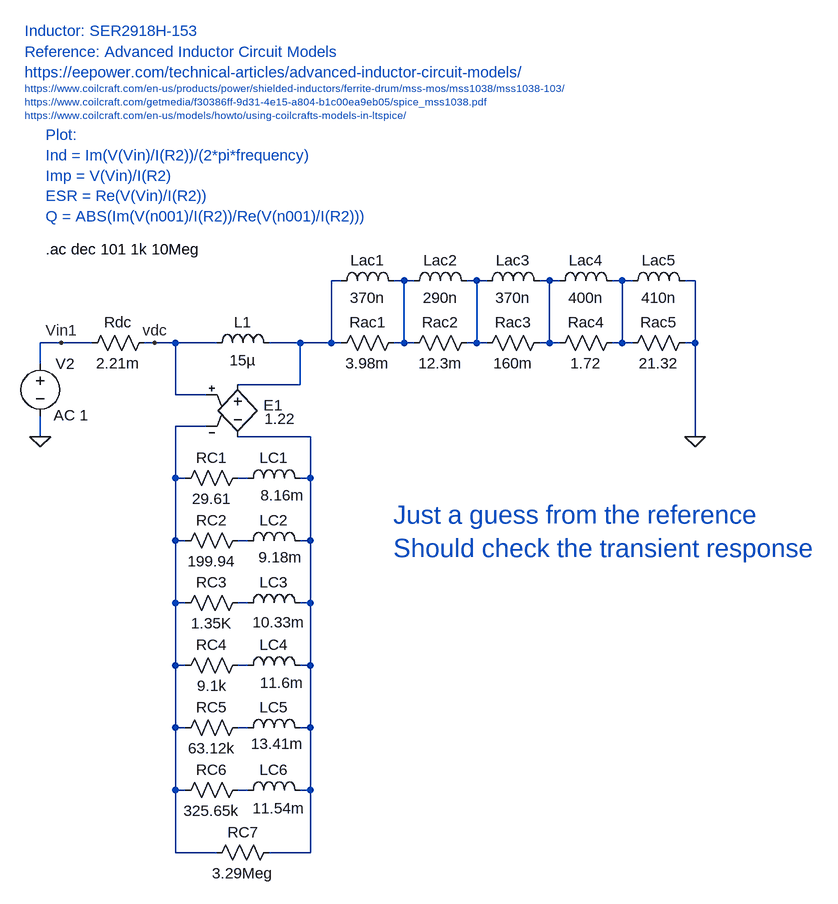
[diagram p0: schematic 08-SER2918H-153_non-linear_model_ridley.asc]
08-SER2918H-153_non-linear_model_ridley.asc, the LTspice schematic file:
Version 4
SHEET 1 1668 1520
WIRE 96 112 80 112
WIRE 192 112 176 112
WIRE 208 112 192 112
WIRE 304 112 288 112
WIRE 320 112 304 112
WIRE 416 112 400 112
WIRE 432 112 416 112
WIRE 528 112 512 112
WIRE 544 112 528 112
WIRE 640 112 624 112
WIRE -336 208 -368 208
WIRE -288 208 -336 208
WIRE -192 208 -208 208
WIRE -160 208 -192 208
WIRE -96 208 -160 208
WIRE 32 208 -16 208
WIRE 80 208 80 112
WIRE 80 208 32 208
WIRE 96 208 80 208
WIRE 192 208 192 112
WIRE 192 208 176 208
WIRE 208 208 192 208
WIRE 304 208 304 112
WIRE 304 208 288 208
WIRE 320 208 304 208
WIRE 416 208 416 112
WIRE 416 208 400 208
WIRE 432 208 416 208
WIRE 528 208 528 112
WIRE 528 208 512 208
WIRE 544 208 528 208
WIRE 640 208 640 112
WIRE 640 208 624 208
WIRE -368 240 -368 208
WIRE 32 272 32 208
WIRE 32 272 -64 272
WIRE -160 288 -160 208
WIRE -112 288 -160 288
WIRE -112 336 -160 336
WIRE -368 352 -368 320
WIRE 48 352 -64 352
WIRE 640 352 640 208
WIRE -160 416 -160 336
WIRE -144 416 -160 416
WIRE -48 416 -64 416
WIRE 48 416 48 352
WIRE 48 416 32 416
WIRE -160 512 -160 416
WIRE -144 512 -160 512
WIRE -48 512 -64 512
WIRE 48 512 48 416
WIRE 48 512 32 512
WIRE -160 608 -160 512
WIRE -144 608 -160 608
WIRE -48 608 -64 608
WIRE 48 608 48 512
WIRE 48 608 32 608
WIRE -160 704 -160 608
WIRE -144 704 -160 704
WIRE -48 704 -64 704
WIRE 48 704 48 608
WIRE 48 704 32 704
WIRE -160 800 -160 704
WIRE -144 800 -160 800
WIRE -48 800 -64 800
WIRE 48 800 48 704
WIRE 48 800 32 800
WIRE -160 896 -160 800
WIRE -144 896 -160 896
WIRE -48 896 -64 896
WIRE 48 896 48 800
WIRE 48 896 32 896
WIRE -160 992 -160 896
WIRE -96 992 -160 992
WIRE 48 992 48 896
WIRE 48 992 -16 992
FLAG -368 352 0
FLAG 640 352 0
FLAG -336 208 Vin1
FLAG -192 208 vdc
SYMBOL voltage -368 224 R0
WINDOW 123 21 95 Left 2
WINDOW 39 0 0 Left 0
SYMATTR Value2 AC 1
SYMATTR InstName V2
SYMATTR Value ""
SYMBOL res -192 192 R90
WINDOW 0 0 56 VBottom 2
WINDOW 3 32 56 VTop 2
SYMATTR InstName Rdc
SYMATTR Value 2.21m
SYMBOL res 192 192 R90
WINDOW 0 0 56 VBottom 2
WINDOW 3 32 56 VTop 2
SYMATTR InstName Rac1
SYMATTR Value 3.98m
SYMBOL res 304 192 R90
WINDOW 0 0 56 VBottom 2
WINDOW 3 32 56 VTop 2
SYMATTR InstName Rac2
SYMATTR Value 12.3m
SYMBOL res 416 192 R90
WINDOW 0 0 56 VBottom 2
WINDOW 3 32 56 VTop 2
SYMATTR InstName Rac3
SYMATTR Value 160m
SYMBOL res 528 192 R90
WINDOW 0 0 56 VBottom 2
WINDOW 3 32 56 VTop 2
SYMATTR InstName Rac4
SYMATTR Value 1.72
SYMBOL res 640 192 R90
WINDOW 0 0 56 VBottom 2
WINDOW 3 32 56 VTop 2
SYMATTR InstName Rac5
SYMATTR Value 21.32
SYMBOL ind 80 128 R270
WINDOW 0 32 56 VTop 2
WINDOW 3 5 56 VBottom 2
SYMATTR InstName Lac1
SYMATTR Value 370n
SYMBOL ind 192 128 R270
WINDOW 0 32 56 VTop 2
WINDOW 3 5 56 VBottom 2
SYMATTR InstName Lac2
SYMATTR Value 290n
SYMBOL ind 304 128 R270
WINDOW 0 32 56 VTop 2
WINDOW 3 5 56 VBottom 2
SYMATTR InstName Lac3
SYMATTR Value 370n
SYMBOL ind 416 128 R270
WINDOW 0 32 56 VTop 2
WINDOW 3 5 56 VBottom 2
SYMATTR InstName Lac4
SYMATTR Value 400n
SYMBOL ind 528 128 R270
WINDOW 0 32 56 VTop 2
WINDOW 3 5 56 VBottom 2
SYMATTR InstName Lac5
SYMATTR Value 410n
SYMBOL ind -112 224 R270
WINDOW 0 32 56 VTop 2
WINDOW 3 5 56 VBottom 2
SYMATTR InstName L1
SYMATTR Value 15µ
SYMBOL res -48 400 R90
WINDOW 0 0 56 VBottom 2
WINDOW 3 32 56 VTop 2
SYMATTR InstName RC1
SYMATTR Value 29.61
SYMBOL ind -64 432 R270
WINDOW 0 32 56 VTop 2
WINDOW 3 5 69 VBottom 2
SYMATTR InstName LC1
SYMATTR Value 8.16m
SYMBOL res -48 496 R90
WINDOW 0 0 56 VBottom 2
WINDOW 3 32 56 VTop 2
SYMATTR InstName RC2
SYMATTR Value 199.94
SYMBOL ind -64 528 R270
WINDOW 0 32 56 VTop 2
WINDOW 3 6 66 VBottom 2
SYMATTR InstName LC2
SYMATTR Value 9.18m
SYMBOL res -48 592 R90
WINDOW 0 0 56 VBottom 2
WINDOW 3 32 56 VTop 2
SYMATTR InstName RC3
SYMATTR Value 1.35K
SYMBOL ind -64 624 R270
WINDOW 0 32 56 VTop 2
WINDOW 3 2 63 VBottom 2
SYMATTR InstName LC3
SYMATTR Value 10.33m
SYMBOL res -48 688 R90
WINDOW 0 0 56 VBottom 2
WINDOW 3 32 56 VTop 2
SYMATTR InstName RC4
SYMATTR Value 9.1k
SYMBOL ind -64 720 R270
WINDOW 0 32 56 VTop 2
WINDOW 3 5 68 VBottom 2
SYMATTR InstName LC4
SYMATTR Value 11.6m
SYMBOL res -48 784 R90
WINDOW 0 0 56 VBottom 2
WINDOW 3 32 56 VTop 2
SYMATTR InstName RC5
SYMATTR Value 63.12k
SYMBOL ind -64 816 R270
WINDOW 0 32 56 VTop 2
WINDOW 3 7 61 VBottom 2
SYMATTR InstName LC5
SYMATTR Value 13.41m
SYMBOL res -48 880 R90
WINDOW 0 0 56 VBottom 2
WINDOW 3 32 56 VTop 2
SYMATTR InstName RC6
SYMATTR Value 325.65k
SYMBOL ind -64 912 R270
WINDOW 0 32 56 VTop 2
WINDOW 3 4 63 VBottom 2
SYMATTR InstName LC6
SYMATTR Value 11.54m
SYMBOL res 0 976 R90
WINDOW 0 0 56 VBottom 2
WINDOW 3 32 56 VTop 2
SYMATTR InstName RC7
SYMATTR Value 3.29Meg
SYMBOL e -64 256 R0
WINDOW 0 40 48 Left 2
WINDOW 3 41 69 Left 2
SYMATTR InstName E1
SYMATTR Value 1.22
TEXT -360 64 Left 2 !.ac dec 101 1k 10Meg
TEXT -392 -272 Left 2 ;Inductor: SER2918H-153
TEXT -392 -184 Left 1 ;https://www.coilcraft.com/en-us/products/power/shielded-inductors/ferrite-drum/mss-mos/mss1038/mss1038-103/\nhttps://www.coilcraft.com/getmedia/f30386ff-9d31-4e15-a804-b1c00ea9eb05/spice_mss1038.pdf\nhttps://www.coilcraft.com/en-us/models/howto/using-coilcrafts-models-in-ltspice/
TEXT -360 -112 Left 2 ;Plot:\nInd = Im(V(Vin)/I(R2))/(2*pi*frequency)\nImp = V(Vin)/I(R2)\nESR = Re(V(Vin)/I(R2))\nQ = ABS(Im(V(n001)/I(R2))/Re(V(n001)/I(R2)))
TEXT -392 -240 Left 2 ;Reference: Advanced Inductor Circuit Models\nhttps://eepower.com/technical-articles/advanced-inductor-circuit-models/
TEXT 176 472 Left 4 ;Just a guess from the reference\nShould check the transient response

The netlist it stands for:
* 08-SER2918H-153_non-linear_model_ridley.asc
V2 Vin1 0 AC 1
Rdc vdc Vin1 2.21m
Rac1 N002 N001 3.98m
Rac2 N003 N002 12.3m
Rac3 N004 N003 160m
Rac4 N005 N004 1.72
Rac5 0 N005 21.32
Lac1 N001 N002 370n
Lac2 N002 N003 290n
Lac3 N003 N004 370n
Lac4 N004 N005 400n
Lac5 N005 0 410n
L1 vdc N001 15µ
RC1 N008 N006 29.61
LC1 N008 N007 8.16m
RC2 N009 N006 199.94
LC2 N009 N007 9.18m
RC3 N010 N006 1.35K
LC3 N010 N007 10.33m
RC4 N011 N006 9.1k
LC4 N011 N007 11.6m
RC5 N012 N006 63.12k
LC5 N012 N007 13.41m
RC6 N013 N006 325.65k
LC6 N013 N007 11.54m
RC7 N007 N006 3.29Meg
E1 N001 N007 vdc N006 1.22
.ac dec 101 1k 10Meg
* Inductor: SER2918H-153
* https://www.coilcraft.com/en-us/products/power/shielded-inductors/ferrite-drum/mss-mos/mss1038/mss1038-103/
* https://www.coilcraft.com/getmedia/f30386ff-9d31-4e15-a804-b1c00ea9eb05/spice_mss1038.pdf
* https://www.coilcraft.com/en-us/models/howto/using-coilcrafts-models-in-ltspice/
* Plot:
* Ind = Im(V(Vin)/I(R2))/(2*pi*frequency)
* Imp = V(Vin)/I(R2)
* ESR = Re(V(Vin)/I(R2))
* Q = ABS(Im(V(n001)/I(R2))/Re(V(n001)/I(R2)))
* Reference: Advanced Inductor Circuit Models
* https://eepower.com/technical-articles/advanced-inductor-circuit-models/
* Just a guess from the reference
* Should check the transient response
.backanno
.end

* Results of the author's LTspice run, read from the files saved beside the schematic
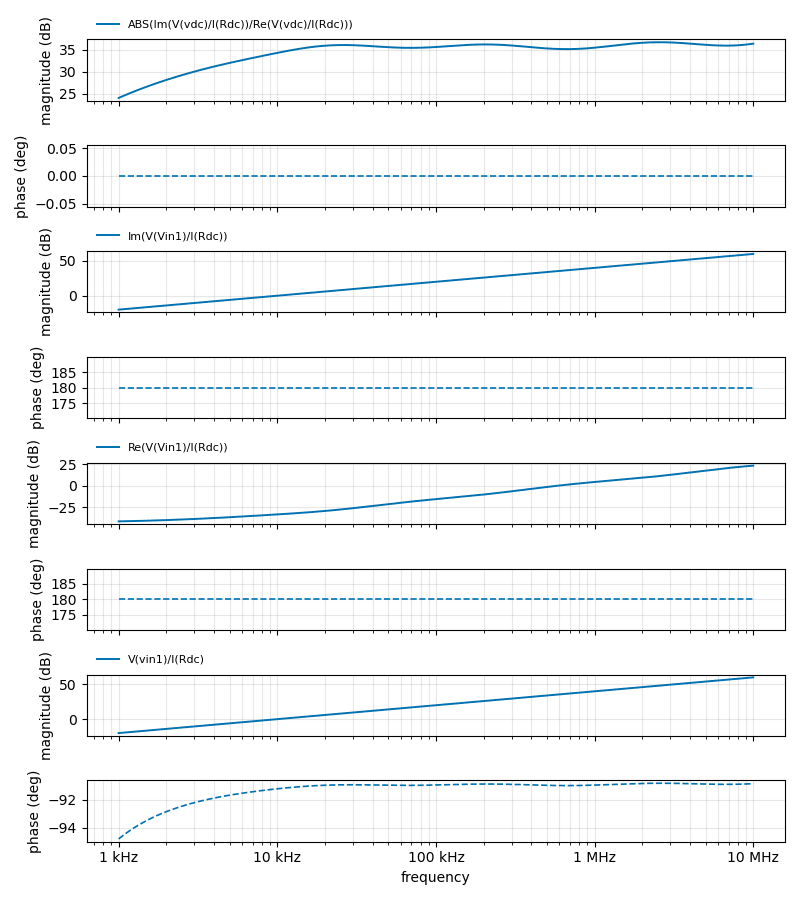
[diagram p1: AC Analysis of 08-SER2918H-153_non-linear_model_ridley.asc, plotted from the saved traces]
* AC Analysis, 1 run:
*   ABS(Im(V(vdc)/I(Rdc))/Re(V(vdc)/I(Rdc))): 24.07 dB at 1 kHz, 36.33 dB at 10 MHz, peak 36.65 dB at 2.546 MHz, 3 dB below the peak at 8.248 kHz
*   Im(V(Vin1)/I(Rdc)): -19.63 dB at 1 kHz, 59.58 dB at 10 MHz, peak 59.58 dB at 10 MHz, 3 dB below the peak at 7.037 MHz
*   Re(V(Vin1)/I(Rdc)): -41.17 dB at 1 kHz, 23.25 dB at 10 MHz, peak 23.25 dB at 10 MHz, 3 dB below the peak at 6.675 MHz
*   V(vin1)/I(Rdc): -19.60 dB at 1 kHz, 59.58 dB at 10 MHz, peak 59.58 dB at 10 MHz, 3 dB below the peak at 7.037 MHz